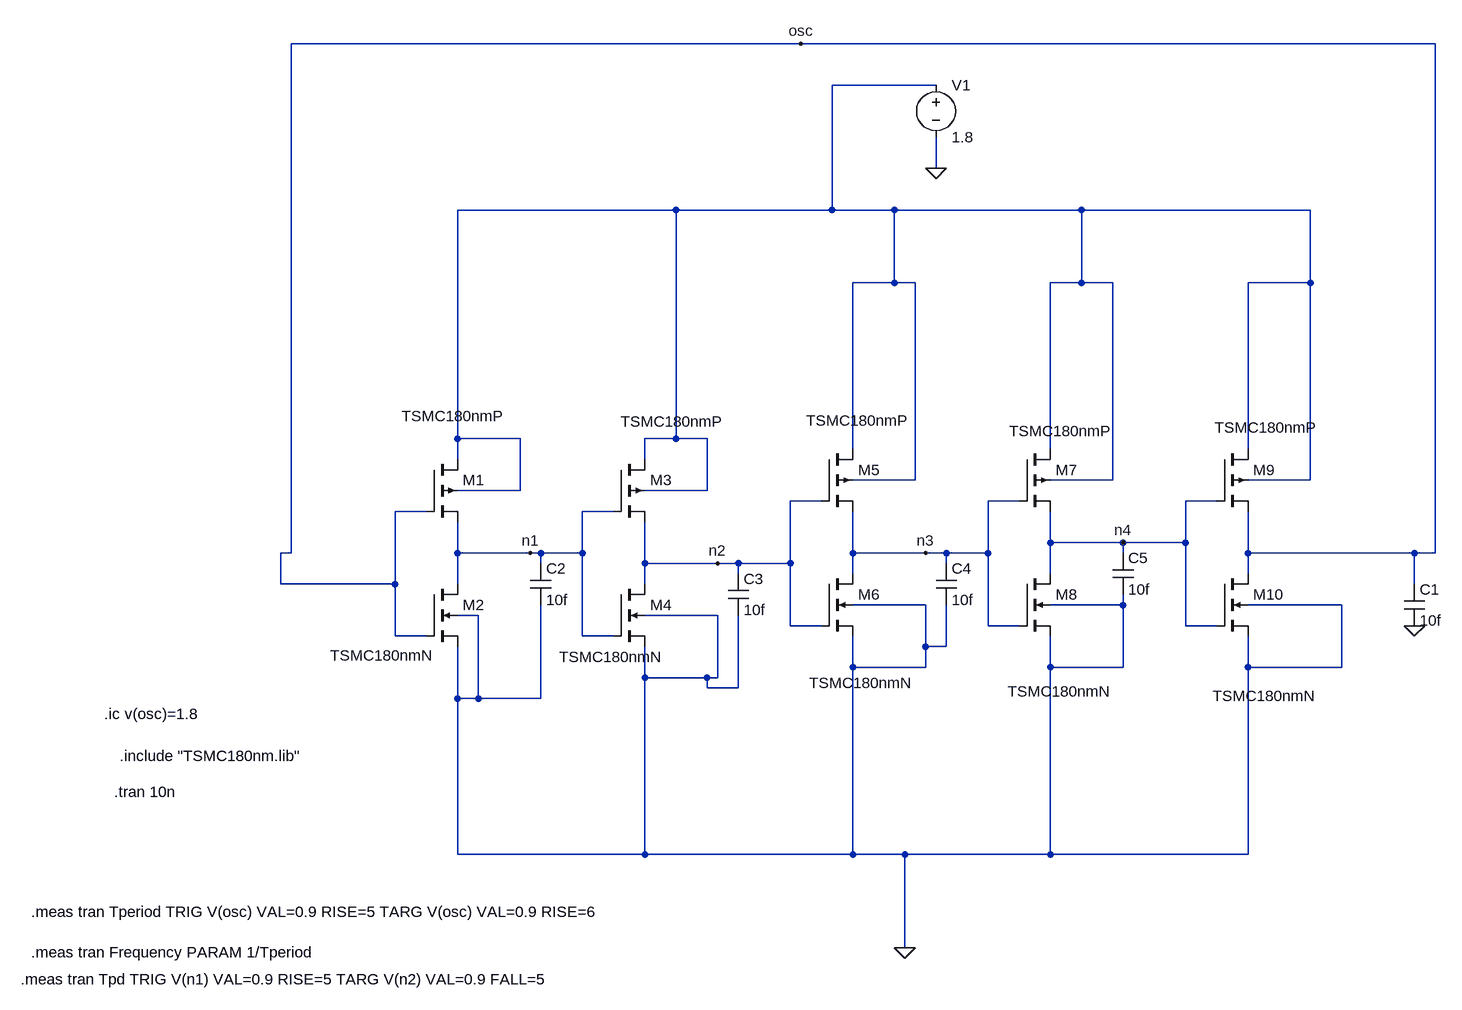
[diagram p0: schematic 5 Stage Ring Oscillator.asc]
5 Stage Ring Oscillator.asc, the LTspice schematic file:
Version 4.1
SHEET 1 1920 832
WIRE 928 -624 144 -624
WIRE 1904 -624 928 -624
WIRE 1136 -560 976 -560
WIRE 1136 -432 1136 -480
WIRE 736 -368 400 -368
WIRE 976 -368 976 -560
WIRE 976 -368 736 -368
WIRE 1072 -368 976 -368
WIRE 1360 -368 1072 -368
WIRE 1712 -368 1360 -368
WIRE 1072 -256 1072 -368
WIRE 1072 -256 1008 -256
WIRE 1104 -256 1072 -256
WIRE 1360 -256 1360 -368
WIRE 1360 -256 1312 -256
WIRE 1408 -256 1360 -256
WIRE 1712 -256 1712 -368
WIRE 1712 -256 1616 -256
WIRE 400 -16 400 -368
WIRE 496 -16 400 -16
WIRE 736 -16 736 -368
WIRE 736 -16 688 -16
WIRE 784 -16 736 -16
WIRE 1008 0 1008 -256
WIRE 1312 0 1312 -256
WIRE 1616 0 1616 -256
WIRE 400 16 400 -16
WIRE 688 16 688 -16
WIRE 1104 48 1104 -256
WIRE 1104 48 1008 48
WIRE 1408 48 1408 -256
WIRE 1408 48 1312 48
WIRE 1712 48 1712 -256
WIRE 1712 48 1616 48
WIRE 496 64 496 -16
WIRE 496 64 400 64
WIRE 784 64 784 -16
WIRE 784 64 688 64
WIRE 960 80 912 80
WIRE 1264 80 1216 80
WIRE 1568 80 1520 80
WIRE 352 96 304 96
WIRE 640 96 592 96
WIRE 1312 144 1312 96
WIRE 1424 144 1312 144
WIRE 1520 144 1520 80
WIRE 1520 144 1424 144
WIRE 144 160 144 -624
WIRE 144 160 128 160
WIRE 400 160 400 112
WIRE 512 160 400 160
WIRE 528 160 512 160
WIRE 592 160 592 96
WIRE 592 160 528 160
WIRE 1008 160 1008 96
WIRE 1120 160 1008 160
WIRE 1152 160 1120 160
WIRE 1216 160 1216 80
WIRE 1216 160 1152 160
WIRE 1424 160 1424 144
WIRE 1616 160 1616 96
WIRE 1872 160 1616 160
WIRE 1904 160 1904 -624
WIRE 1904 160 1872 160
WIRE 528 176 528 160
WIRE 688 176 688 112
WIRE 800 176 688 176
WIRE 832 176 800 176
WIRE 912 176 912 80
WIRE 912 176 832 176
WIRE 1152 176 1152 160
WIRE 832 192 832 176
WIRE 1008 192 1008 160
WIRE 1312 192 1312 144
WIRE 1616 192 1616 160
WIRE 128 208 128 160
WIRE 304 208 304 96
WIRE 304 208 128 208
WIRE 400 208 400 160
WIRE 688 208 688 176
WIRE 1872 208 1872 160
WIRE 1120 240 1008 240
WIRE 1424 240 1424 224
WIRE 1424 240 1312 240
WIRE 1760 240 1616 240
WIRE 432 256 400 256
WIRE 800 256 688 256
WIRE 912 272 912 176
WIRE 960 272 912 272
WIRE 1216 272 1216 160
WIRE 1264 272 1216 272
WIRE 1520 272 1520 144
WIRE 1568 272 1520 272
WIRE 304 288 304 208
WIRE 352 288 304 288
WIRE 592 288 592 160
WIRE 640 288 592 288
WIRE 1120 304 1120 240
WIRE 1152 304 1152 240
WIRE 1152 304 1120 304
WIRE 1008 336 1008 288
WIRE 1120 336 1120 304
WIRE 1120 336 1008 336
WIRE 1312 336 1312 288
WIRE 1424 336 1424 240
WIRE 1424 336 1312 336
WIRE 1616 336 1616 288
WIRE 1760 336 1760 240
WIRE 1760 336 1616 336
WIRE 688 352 688 304
WIRE 784 352 688 352
WIRE 800 352 800 256
WIRE 800 352 784 352
WIRE 784 368 784 352
WIRE 832 368 832 256
WIRE 832 368 784 368
WIRE 400 384 400 304
WIRE 432 384 432 256
WIRE 432 384 400 384
WIRE 528 384 528 240
WIRE 528 384 432 384
WIRE 400 624 400 384
WIRE 688 624 688 352
WIRE 688 624 400 624
WIRE 1008 624 1008 336
WIRE 1008 624 688 624
WIRE 1088 624 1008 624
WIRE 1312 624 1312 336
WIRE 1312 624 1088 624
WIRE 1616 624 1616 336
WIRE 1616 624 1312 624
WIRE 1088 768 1088 624
FLAG 1088 768 0
FLAG 1136 -432 0
FLAG 928 -624 osc
FLAG 512 160 n1
FLAG 800 176 n2
FLAG 1120 160 n3
FLAG 1424 144 n4
FLAG 1872 272 0
SYMBOL pmos4 352 16 R0
WINDOW 3 -38 -67 Left 2
SYMATTR Value TSMC180nmP
SYMATTR InstName M1
SYMATTR Value2 l=180n w=2u
SYMBOL nmos4 352 208 R0
WINDOW 3 -148 110 Left 2
SYMATTR Value TSMC180nmN
SYMATTR InstName M2
SYMATTR Value2 l=180n w=1u
SYMBOL pmos4 640 16 R0
WINDOW 3 11 -58 Left 2
SYMATTR Value TSMC180nmP
SYMATTR InstName M3
SYMATTR Value2 l=180n w=2u
SYMBOL nmos4 640 208 R0
WINDOW 3 -84 112 Left 2
SYMATTR Value TSMC180nmN
SYMATTR InstName M4
SYMATTR Value2 l=180n w=1u
SYMBOL pmos4 960 0 R0
WINDOW 3 -24 -44 Left 2
SYMATTR Value TSMC180nmP
SYMATTR InstName M5
SYMATTR Value2 l=180n w=2u
SYMBOL nmos4 960 192 R0
WINDOW 3 -19 168 Left 2
SYMATTR Value TSMC180nmN
SYMATTR InstName M6
SYMATTR Value2 l=180n w=1u
SYMBOL pmos4 1264 0 R0
WINDOW 3 -15 -28 Left 2
SYMATTR Value TSMC180nmP
SYMATTR InstName M7
SYMATTR Value2 l=180n w=2u
SYMBOL nmos4 1264 192 R0
WINDOW 3 -18 181 Left 2
SYMATTR Value TSMC180nmN
SYMATTR InstName M8
SYMATTR Value2 l=180n w=1u
SYMBOL pmos4 1568 0 R0
WINDOW 3 -3 -33 Left 2
SYMATTR Value TSMC180nmP
SYMATTR InstName M9
SYMATTR Value2 l=180n w=2u
SYMBOL nmos4 1568 192 R0
WINDOW 3 -6 188 Left 2
SYMATTR Value TSMC180nmN
SYMATTR InstName M10
SYMATTR Value2 l=180n w=1u
SYMBOL voltage 1136 -576 R0
WINDOW 123 0 0 Left 0
WINDOW 39 0 0 Left 0
SYMATTR InstName V1
SYMATTR Value 1.8
SYMBOL cap 1856 208 R0
SYMATTR InstName C1
SYMATTR Value 10f
SYMBOL cap 512 176 R0
SYMATTR InstName C2
SYMATTR Value 10f
SYMBOL cap 816 192 R0
SYMATTR InstName C3
SYMATTR Value 10f
SYMBOL cap 1136 176 R0
SYMATTR InstName C4
SYMATTR Value 10f
SYMBOL cap 1408 160 R0
SYMATTR InstName C5
SYMATTR Value 10f
TEXT -120 472 Left 2 !.include "TSMC180nm.lib"
TEXT -128 528 Left 2 !.tran 10n
TEXT -256 712 Left 2 !.meas tran Tperiod TRIG V(osc) VAL=0.9 RISE=5 TARG V(osc) VAL=0.9 RISE=6\n \n.meas tran Frequency PARAM 1/Tperiod
TEXT -272 816 Left 2 !.meas tran Tpd TRIG V(n1) VAL=0.9 RISE=5 TARG V(n2) VAL=0.9 FALL=5
TEXT -144 408 Left 2 !.ic v(osc)=1.8

The netlist it stands for:
* 5 Stage Ring Oscillator.asc
M1 N001 osc n1 N001 TSMC180nmP l=180n w=2u
M2 n1 osc 0 0 TSMC180nmN l=180n w=1u
M3 N001 n1 n2 N001 TSMC180nmP l=180n w=2u
M4 n2 n1 0 0 TSMC180nmN l=180n w=1u
M5 N001 n2 n3 N001 TSMC180nmP l=180n w=2u
M6 n3 n2 0 0 TSMC180nmN l=180n w=1u
M7 N001 n3 n4 N001 TSMC180nmP l=180n w=2u
M8 n4 n3 0 0 TSMC180nmN l=180n w=1u
M9 N001 n4 osc N001 TSMC180nmP l=180n w=2u
M10 osc n4 0 0 TSMC180nmN l=180n w=1u
V1 N001 0 1.8
C1 osc 0 10f
C2 n1 0 10f
C3 n2 0 10f
C4 n3 0 10f
C5 n4 0 10f
.model NMOS NMOS
.model PMOS PMOS
.lib standard.mos
.include "TSMC180nm.lib"
.tran 10n
.meas tran Tperiod TRIG V(osc) VAL=0.9 RISE=5 TARG V(osc) VAL=0.9 RISE=6
.meas tran Frequency PARAM 1/Tperiod
.meas tran Tpd TRIG V(n1) VAL=0.9 RISE=5 TARG V(n2) VAL=0.9 FALL=5
.ic v(osc)=1.8
.backanno
.end